# Altium schematic sheet Misc.SchDoc
size A4; SheetNumber: 8; SheetTotal: 8
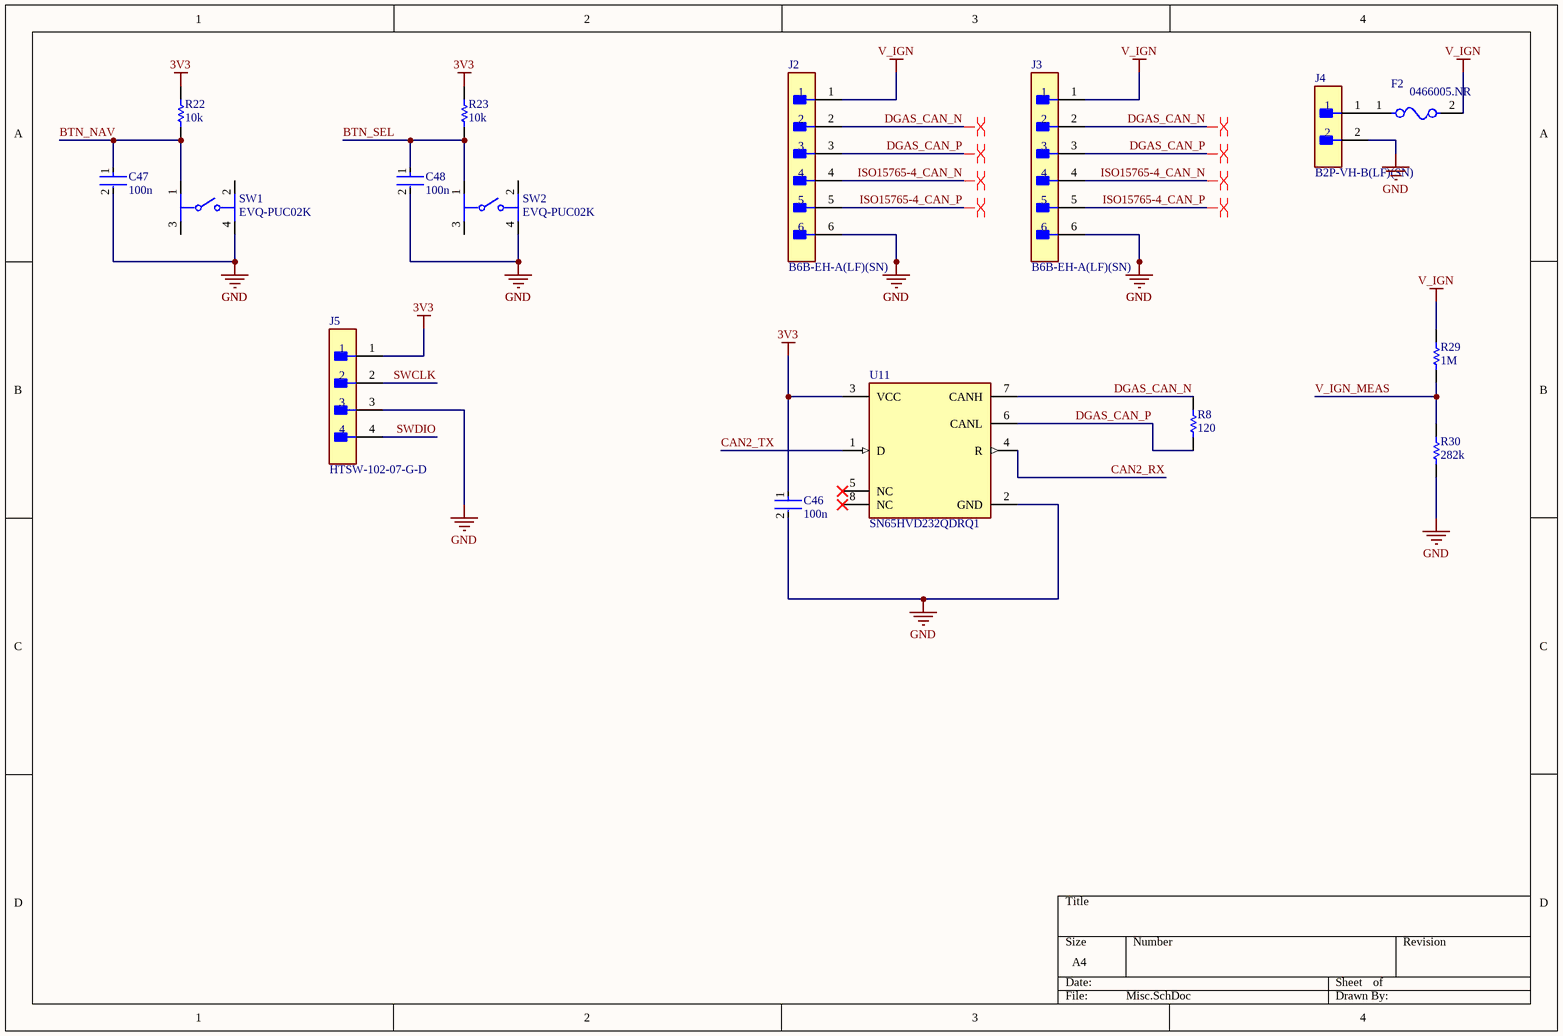
[diagram p0: Misc.SchDoc]

## Parts
C46  100n  [FP-GRM188-0_1-e0_2_0_55-IPC_A]
C47  100n  [FP-GRM188-0_1-e0_2_0_55-IPC_A]
C48  100n  [FP-GRM188-0_1-e0_2_0_55-IPC_A]
F2  0466005.NR  [FP-0466-MFG]
J2  B6B-EH-A(LF)(SN)  [FP-B6B-EH-A_LF_SN-MFG]
J3  B6B-EH-A(LF)(SN)  [FP-B6B-EH-A_LF_SN-MFG]
J4  B2P-VH-B(LF)(SN)  [FP-B2P-VH-B_LF_SN-MFG]
J5  HTSW-102-07-G-D  [FP-HTSW-102-07-G-D-MFG]
R8  120  [RESC1608X55X30ML15T15]
R22  10k  [RESC1609X50X30NL8T20]
R23  10k  [RESC1609X50X30NL8T20]
R29  1M  [RESC1609X50X30NL8T20]
R30  282k  [RESC1609X50X30NL8T20]
SW1  EVQ-PUC02K  [FP-EVQ-PUC02K-MFG]
SW2  EVQ-PUC02K  [FP-EVQ-PUC02K-MFG]
U11  SN65HVD232QDRQ1  [FP-D0008A-MFG]

## Nets
3V3: C46.1 J5.1 R22.2 R23.2 U11.3(VCC)
GND: C46.2 C47.2 C48.2 J2.6 J3.6 J4.2 J5.3 R30.1 SW1.4 SW2.4 U11.2(GND)
V_IGN: F2.2 J2.1 J3.1 R29.2
BTN_NAV: C47.1 R22.1 SW1.1
BTN_SEL: C48.1 R23.1 SW2.1
CAN2_RX: U11.4(R)
CAN2_TX: U11.1(D)
DGAS_CAN_N: J2.2 J3.2 R8.2 U11.7(CANH)
DGAS_CAN_P: J2.3 J3.3 R8.1 U11.6(CANL)
ISO15765-4_CAN_N: J2.4 J3.4
ISO15765-4_CAN_P: J2.5 J3.5
SWCLK: J5.2
SWDIO: J5.4
V_IGN_MEAS: R29.1 R30.2
NetF2_1: F2.1 J4.1

Not connected (* = marked no-connect by the designer): SW1 2 3; SW2 2 3; U11 5(NC)* 8(NC)*

## Layout directives
differential pair: DGAS_CAN_N, DGAS_CAN_P, ISO15765-4_CAN_N, ISO15765-4_CAN_P

## Library data of the parts
C46-C48 = CMP-2006-02792-2: Chip Multilayer Ceramic Capacitors for General Purpose, 0603, 10uF, X5R, 15%, 20%, 6.3V; Packaging: Tape and Reel; Voltage Rating (DC): 6.3V; Width: 0.031inch; Termination: SMD/SMT; Dielectric: X5R; Package Quantity: 4000; Voltage Rating: 6.3V; Capacitance: 10uF; Case/Package: 0603; Min Operating Temperature: -55°C; Voltage: 6.3V; Length: 1.6mm; Thickness: 0.035inch; Lead Free: Lead Free; Depth: 0.8mm; Case Code (Imperial): 0603; Max Operating Temperature: 85°C; Material: Ceramic; Height: 0.8mm; Tolerance: 20%; Mount: Surface Mount; REACH SVHC: No SVHC; Radiation Hardening: No; Case Code (Metric): 1608
F2 = CMP-08605-000032-1: FUSE BOARD MNT 5A 32VAC/VDC 1206; Manufacturer: Littelfuse Inc; Value: 0.011Ω; Max Fuse Ac Voltage: 32V; Fuse I2T: 2.5A2Sec; Fuse Interrupt Ac Current: 50A; Fuse Blow Speed: Fast; Fuse Voltage Drop: 73.75mV; Category: Fuse; Temperature: -55°C to +90°C; Lead Free: Yes; Temperature Range High: +90°C; RoHS: TRUE; Device Class L2: Fuses; ComponentLink2URL: https://www.littelfuse.com/~/media/electronics/datasheets/fuses/littelfuse_fuse_466_datasheet.pdf.pdf; Fuse Current: 5A; Octopart: https://octopart.com/0466005.nr-littelfuse-143206; Automotive: No; Max Fuse Dc Voltage: 32V; Temperature Range Low: -55°C; Device Class L3: unset; ComponentLink2Description: Datasheet; Manufacturer Part Number: 0466005.NR; Fuse Interrupt Dc Current: 50A; Resistance: 0.011Ω; Package: 0466; Device Class L1: Circuit Protection; Mouser Description: Surface Mount Fuses 32V 5A VFA Slimline; Height: 0.66mm; Voltage Rating: 32V; Digikey Description: FUSE BOARD MNT 5A 32VAC/VDC 1206
J2 J3 = CMP-17439-000293-1: CONN HEADER VERT 6POS 2.5MM; Voltage Rating: 250V; Number of Positions: 6; Current Rating: 3A; Mated Stacking Heights: 8.1mm; Gender: Male; Insulation Material: Nylon; Number of Contacts: 6; Contact Plating: Tin; Pitch: 2.5mm; Orientation: Straight; Insulation Color: Natural; Packaging: Bulk; Termination: Solder; Flammability Rating: UL94 V-0; Lead Free: Lead Free; Contact Mating Length: 0.13inch; Color: Natural; Contact Finish - Mating: TIN; Connector Type: Header; Contact Shape: Square; Contact Type: Male Pin; Series: EH; Contact Material: Brass; Fastening Type: Friction; Number of Rows: 1; Mount: Through Hole; Housing Color: White
J4 = CMP-17439-000297-1: CONN HEADER VERT 2POS 3.96MM; Number of Positions: 2; Pitch: 0.156inch; Voltage Rating: 250V; Termination: Solder; Lead Free: Lead Free; Insulation Color: Natural; Contact Material: Brass; Flammability Rating: UL94 V-0; Packaging: Bulk; Contact Mating Length: 0.303inch; Color: Natural; Contact Shape: Square; Contact Plating: Tin; Number of Rows: 1; Insulation Material: PBT; Connector Type: Header; Contact Finish - Mating: TIN; Mount: Through Hole; Fastening Type: Friction; Contact Type: Male Pin; Series: VH
J5 = CMP-02766-000010-1: CONN HEADER VERT 4POS 2.54MM; Manufacturer: Samtec; Voltage Rating: 550V; Conn Orientation: Straight; Number Of Contacts: 4; Conn Gender: Male; Current Rating: 6.3A; Number Of Rows: 2; Category: Conn; Temperature: -55°C to +125°C; Automotive: No; Digikey Description: CONN HEADER VERT 4POS 2.54MM; ComponentLink2URL: http://suddendocs.samtec.com/catalog_english/htsw_th.pdf; Device Class L2: Headers and Wire Housings; Mouser Description: Conn Unshrouded Header HDR 4 POS 2.54mm Solder ST Thru-Hole Bag; Manufacturer Part Number: HTSW-102-07-G-D; Temperature Range High: +125°C; Contact Material: Gold,Nickel; Temperature Range Low: -55°C; ComponentLink2Description: Datasheet; Device Class L1: Connectors; Pitch: 2.54mm; Octopart: https://octopart.com/htsw-102-07-g-d-samtec-10531767; RoHS: TRUE; Package: HTSW-102-07-G-D; Lead Free: Yes; Device Class L3: unset; Height: 8.71mm
R8 = CMP-2000-00182-1: Part Number: ERJ-3EKF1003V; Manufacturer: Panasonic
R22 R23 R29 R30 = CMP-1666-00005-4: Chip Resistor, 10 KOhm, +/- 1%, 100 mW, -55 to 155 degC, 0603 (1608 Metric), RoHS, Tape and Reel; Manufacturer: Vishay Semiconductor; Voltage Rating: 75 V; Max Operating Temperature: 155 degC; PackageDescription: 2-Pin Surface Mount Device, Body 1.575 x 0.85 mm; ComponentLink1Description: Manufacturer URL; RoHSCompliant: true; PackageReference: 0603; REACH SVHC: Unknown; Length: 1.55 mm; DatasheetVersion: 06/2012; Packaging: Tape and Reel; Min Operating Temperature: -55 degC; Mounting Technology: Surface Mount; ComponentLink2URL: https://datasheet.ciiva.com/11809/0900766b80d98afc-11809037.pdf; Height: 0.45 mm; ComponentLink2Description: Datasheet; Package Quantity: 5000; ComponentLink1URL: http://www.vishay.com/
SW1 SW2 = CMP-05618-000046-1: SWITCH TACTILE SPST-NO 0.05A 12V; Current Rating: 50mA; Operating Force: 2.2N; Actuator Color: Black; Mechanical Life: 100000Cycles; Switch Function: Off-Mom; Switch Travel: 0.3mm; Throw Configuration: SPST; Contact Resistance: 500mR; Illumination Type: Non-Illuminated; Actuator Length: 1mm; Mount: Surface Mount; Contact Plating: Silver; Series: EVQPU; Packaging: Tape and Reel; Height: 1.65mm; Radiation Hardening: No; Termination: Gull Wing; Depth: 4.5mm; Max Operating Temperature: 70°C; RoHS Compliant: Yes; Contact Current Rating: 50mA; Length: 6.4mm; Electrical Life: 100000Cycles; Max Voltage Rating (DC): 12V; Package Quantity: 1; Width: 3.5mm; Min Operating Temperature: -40°C; Max Current Rating: 50mA; Orientation: Straight; Voltage Rating (DC): 12V; Size: 3.5mm; Lead Free: Lead Free
U11 = CMP-04872-000052-1: IC TRANSCEIVER HALF 1/1 8SOIC; Max Supply Current: 17mA; Data Rate: 1Mbps; Number of Receive Buffers: 1; Max Supply Voltage: 3.6V; Operating Supply Voltage: 3.3V; Interface: CAN; Min Supply Voltage: 3V; Contact Plating: Gold; Case/Package: SOIC; Mount: Surface Mount; Number of Transceivers: 1; Number of Drivers: 1; Package Quantity: 2500; Number of Pins: 8; REACH SVHC: No SVHC; RoHS Compliant: Yes; Series: -; Supply Current: 17mA; Radiation Hardening: No; Nominal Supply Current: 17mA; Lead Free: Lead Free; Number of Transmit Buffers: 1; Max Operating Temperature: 125°C; Packaging: Tape and Reel; Weight: 0.002822oz; Min Operating Temperature: -40°C